# EAGLE schematic brush (EAGLE 9.5.1)
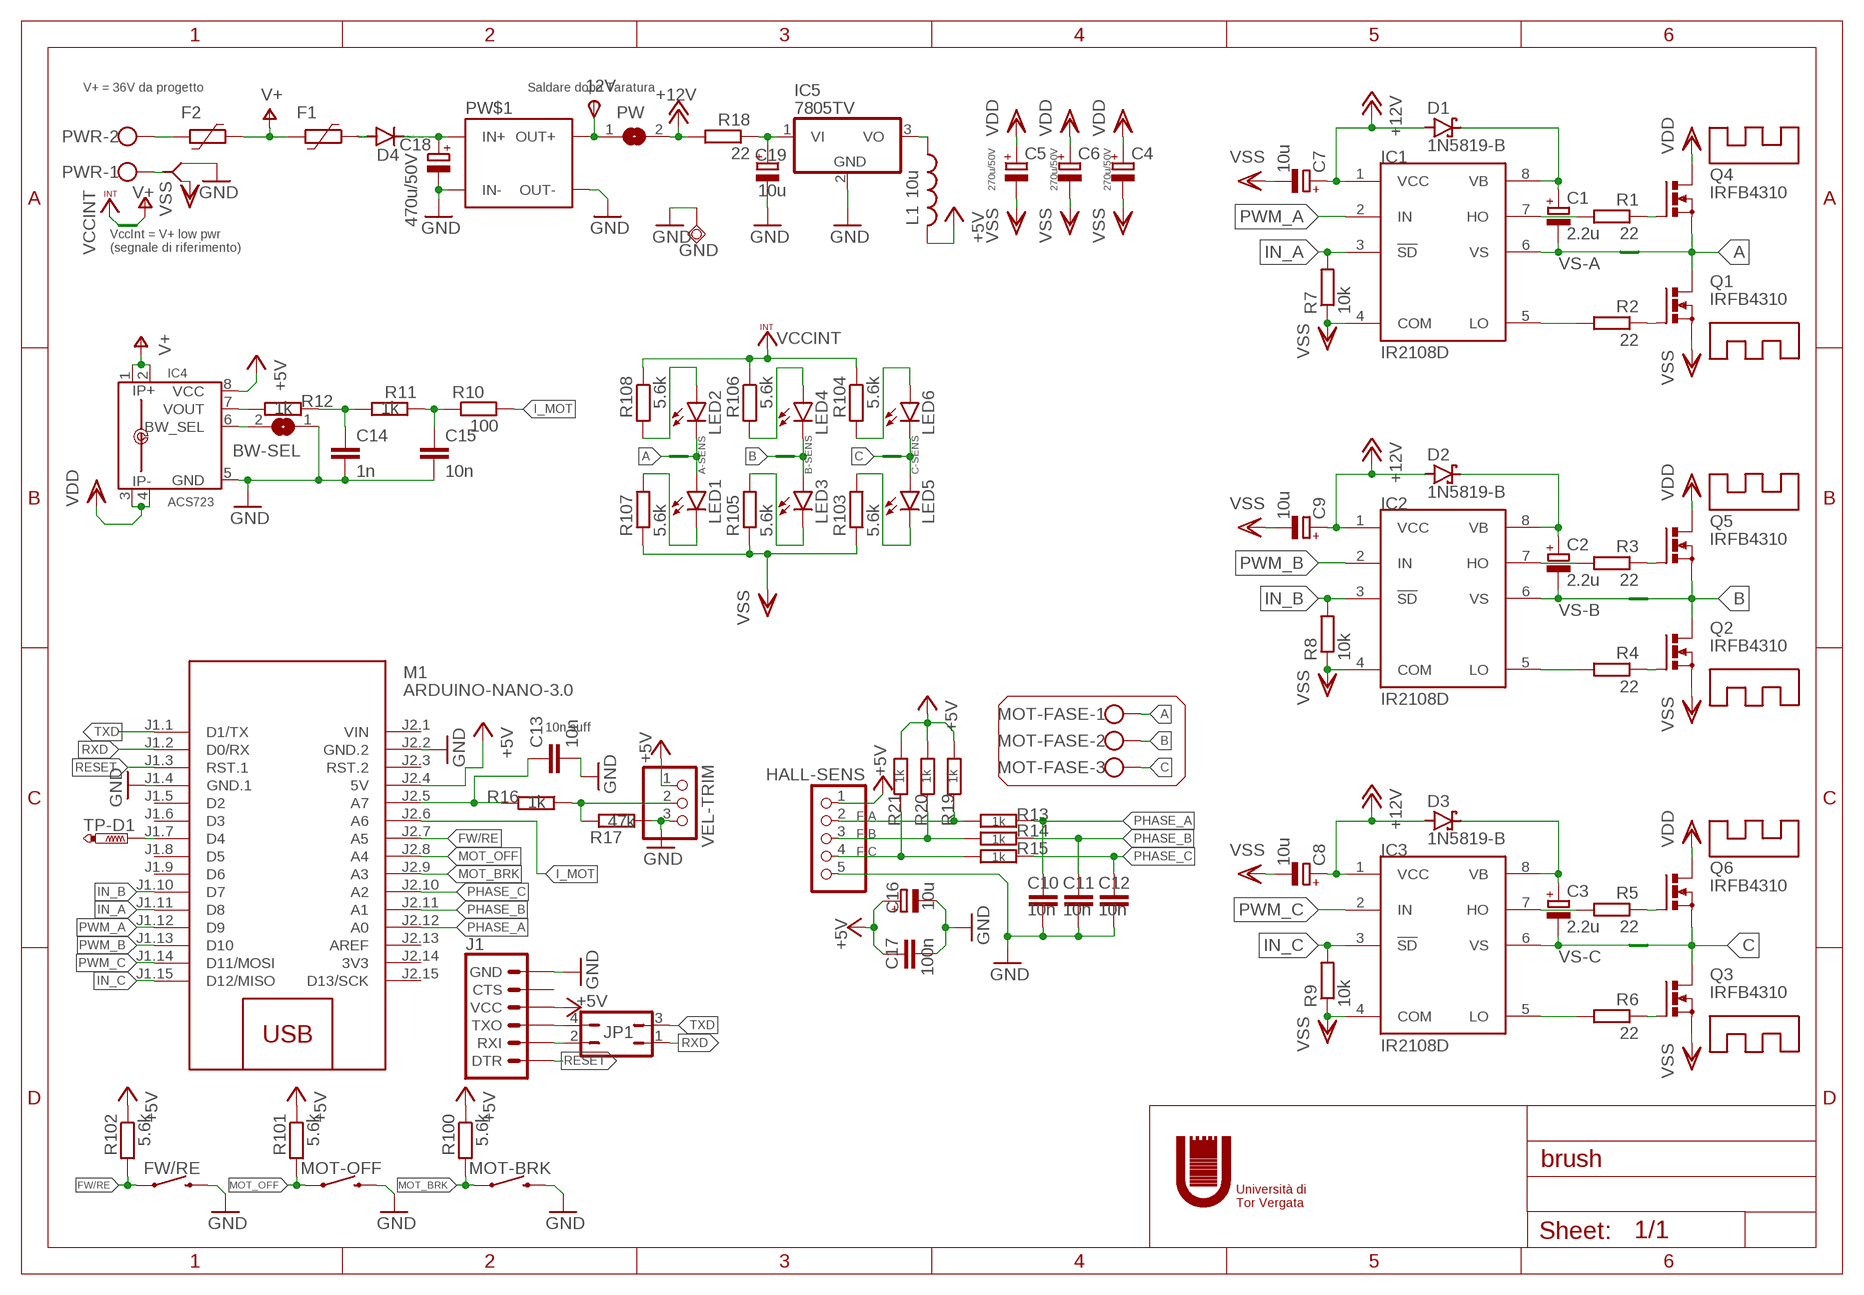
[diagram p0: schematic, sheet 1]

## Parts
12V  TPSPAD1-13  [P1-13]
BW-SEL  SJ  [SJ]
C1  2.2u  CPOL-EUE5-6  [E5-6]
C2  2.2u  CPOL-EUE5-6  [E5-6]
C3  2.2u  CPOL-EUE5-6  [E5-6]
C4  270u/50V  CPOL-EUE7.5-18  [E7,5-18]
C5  270u/50V  CPOL-EUE7.5-18  [E7,5-18]
C6  270u/50V  CPOL-EUE7.5-18  [E7,5-18]
C7  10u  CPOL-EUE5-6  [E5-6]
C8  10u  CPOL-EUE5-6  [E5-6]
C9  10u  CPOL-EUE5-6  [E5-6]
C10  10n  C-EU025-025X050  [C025-025X050]
C11  10n  C-EU025-025X050  [C025-025X050]
C12  10n  C-EU025-025X050  [C025-025X050]
C13  10n  C-EU025-025X050  [C025-025X050]
C14  1n  C-EU025-025X050  [C025-025X050]
C15  10n  C-EU025-025X050  [C025-025X050]
C16  10u  CPOL-EUE5-6  [E5-6]
C17  100n  C-EU025-025X050  [C025-025X050]
C18  470u/50V  CPOL-EUE5-13  [E5-13]
C19  10u  CPOL-EUE5-6  [E5-6]
D1  1N5819-B  [DO41-7.6]
D2  1N5819-B  [DO41-7.6]
D3  1N5819-B  [DO41-7.6]
D4  ES2D  [SMB]
F1  2410-BOX  [BELFUSE0679-3000-12]
F2  2410-BOX  [BELFUSE0679-3000-12]
FW/RE  MOMENTARY-SWITCH-SPST-PTH-6.0MM  [TACTILE_SWITCH_PTH_6.0MM]
GND  TPSQPAD1-13  [P1-13]
HALL-SENS  PINHD-1X5  [1X05]
IC1  IR2108D  [DIL08]
IC2  IR2108D  [DIL08]
IC3  IR2108D  [DIL08]
IC4  ACS723  [SOIC8]
IC5  7805TV  [TO220V]
J1  6_PIN_SERIAL_TARGETSILK  [6_PIN_SERIAL_TARGET_SIDE_W_SILK]
JP1  JP2Q  [JP2Q]
L1  10u  L-US0207/5V  [0207/5V]
LED1  LED3MM  [LED3MM]
LED2  LED3MM  [LED3MM]
LED3  LED3MM  [LED3MM]
LED4  LED3MM  [LED3MM]
LED5  LED3MM  [LED3MM]
LED6  LED3MM  [LED3MM]
M1  ARDUINO-NANO-3.0  [ARDUINO-NANO-3.0]
MOT-BRK  MOMENTARY-SWITCH-SPST-PTH-6.0MM  [TACTILE_SWITCH_PTH_6.0MM]
MOT-FASE  W237-103  [W237-103]
MOT-OFF  MOMENTARY-SWITCH-SPST-PTH-6.0MM  [TACTILE_SWITCH_PTH_6.0MM]
PW  SJ  [SJ]
PW$1  DC/DC-STEP-DOWNOLD-ALFY  [DC-DC-STEP-DOWN-LM2596-ALFY]
PWR  W237-102  [W237-102]
Q1  IRFB4310  PMOSFET_NTO220BV  [TO220BV]
Q2  IRFB4310  PMOSFET_NTO220BV  [TO220BV]
Q3  IRFB4310  PMOSFET_NTO220BV  [TO220BV]
Q4  IRFB4310  PMOSFET_NTO220BV  [TO220BV]
Q5  IRFB4310  PMOSFET_NTO220BV  [TO220BV]
Q6  IRFB4310  PMOSFET_NTO220BV  [TO220BV]
R1  22  R-EU_R1206  [R1206]
R2  22  R-EU_R1206  [R1206]
R3  22  R-EU_R1206  [R1206]
R4  22  R-EU_R1206  [R1206]
R5  22  R-EU_R1206  [R1206]
R6  22  R-EU_R1206  [R1206]
R7  10k  R-EU_R1206  [R1206]
R8  10k  R-EU_R1206  [R1206]
R9  10k  R-EU_R1206  [R1206]
R10  100  R-EU_R1206  [R1206]
R11  1k  R-EU_R1206  [R1206]
R12  1k  R-EU_R1206  [R1206]
R13  1k  R-EU_R1206  [R1206]
R14  1k  R-EU_R1206  [R1206]
R15  1k  R-EU_R1206  [R1206]
R16  1k  R-EU_R1206  [R1206]
R17  47k  R-EU_R1206  [R1206]
R18  22  R-EU_0204/7  [0204/7]
R19  1k  R-EU_R1206  [R1206]
R20  1k  R-EU_R1206  [R1206]
R21  1k  R-EU_R1206  [R1206]
R100  5.6k  R-EU_R1206  [R1206]
R101  5.6k  R-EU_R1206  [R1206]
R102  5.6k  R-EU_R1206  [R1206]
R103  5.6k  R-EU_R1206  [R1206]
R104  5.6k  R-EU_R1206  [R1206]
R105  5.6k  R-EU_R1206  [R1206]
R106  5.6k  R-EU_R1206  [R1206]
R107  5.6k  R-EU_R1206  [R1206]
R108  5.6k  R-EU_R1206  [R1206]
TP-D1  PTR1PAD1-17  [P1-17]
U$1  NET12X12  [NET-NET_12X12MIL]
U$2  NET12X12  [NET-NET_12X12MIL]
U$3  DISSTO-220  [TO-220]
U$4  DISSTO-220  [TO-220]
U$6  NET12X12  [NET-NET_12X12MIL]
U$7  DISSTO-220  [TO-220]
U$8  DISSTO-220  [TO-220]
U$9  DISSTO-220  [TO-220]
U$10  DISSTO-220  [TO-220]
U$11  NET12X12  [NET-NET_12X12MIL]
U$12  NET12X12  [NET-NET_12X12MIL]
U$13  NET12X12  [NET-NET_12X12MIL]
U$14  NET12X12  [NET-NET_12X12MIL]
U$100  3NET25X50MIL  [3NET-25X50MIL]
VEL-TRIM  PINHD-1X3  [1X03]

## Nets
+5V [PWR_logic]: C16.+ C17.1 HALL-SENS.1 IC4.8(VCC) J1.P$4(VCC) L1.2 M1.J2.4(5V) R19.2 R20.2 R21.2 R100.1 R101.1 R102.1 VEL-TRIM.1
+12V [PWR_logic]: C7.+ C8.+ C9.+ D1.A D2.A D3.A IC1.1(VCC) IC2.1(VCC) IC3.1(VCC) PW.2 R18.2
A [PWR_Mot]: MOT-FASE.1 Q1.D Q4.S U$1.N2 U$11.N2
A-SENS [AC_signal]: LED1.A LED2.K(C) U$1.N1
B [PWR_Mot]: MOT-FASE.2 Q2.D Q5.S U$2.N2 U$13.N2
B-SENS [AC_signal]: LED3.A LED4.K(C) U$2.N1
C [PWR_Mot]: MOT-FASE.3 Q3.D Q6.S U$6.N2 U$12.N2
C-SENS [AC_signal]: LED5.A LED6.K(C) U$6.N1
F-A: HALL-SENS.2 R13.2 R19.1
F-B: HALL-SENS.3 R14.2 R20.1
F-C: HALL-SENS.4 R15.2 R21.1
FW/RE: FW/RE.1 M1.J2.7(A5) R102.2
GND [PWR_logic]: BW-SEL.1 C10.2 C11.2 C12.2 C13.2 C14.2 C15.2 C16.- C17.2 C18.- C19.- FW/RE.3 GND.TP HALL-SENS.5 IC4.5(GND) IC5.2(GND) J1.P$6(GND) M1.J1.4(GND.1) M1.J2.2(GND.2) MOT-BRK.3 MOT-OFF.3 PW$1.IN- PW$1.OUT- R17.2 U$100.S2 VEL-TRIM.3
I_MOT: M1.J2.6(A6) R10.2
IN_A: IC1.3(!SD) M1.J1.11(D8) R7.2
IN_B: IC2.3(!SD) M1.J1.10(D7) R8.2
IN_C: IC3.3(!SD) M1.J1.15(D12/MISO) R9.2
MOT_BRK: M1.J2.9(A3) MOT-BRK.1 R100.2
MOT_OFF: M1.J2.8(A4) MOT-OFF.1 R101.2
N$1 [PWR_logic]: IC1.7(HO) R1.2
N$2 [PWR_logic]: IC1.5(LO) R2.2
N$3 [PWR_logic]: Q4.G R1.1
N$4 [PWR_logic]: Q1.G R2.1
N$5 [PWR_logic]: IC2.7(HO) R3.2
N$6 [PWR_logic]: Q5.G R3.1
N$7 [PWR_logic]: IC2.5(LO) R4.2
N$8 [PWR_logic]: Q2.G R4.1
N$9 [PWR_logic]: IC3.7(HO) R5.2
N$10 [PWR_logic]: Q6.G R5.1
N$11 [PWR_logic]: IC3.5(LO) R6.2
N$12 [PWR_logic]: Q3.G R6.1
N$13 [PWR_Mot]: F2.2 PWR.2
N$14 [PWR_logic]: 12V.TP(PP) PW$1.OUT+ PW.1
N$16 [PWR_Mot]: D4.A F1.1
N$18 [PWR_Mot]: PWR.1 U$100.COM
N$19 [AC_signal]: LED2.A R108.2
N$20 [AC_signal]: LED1.K(C) R107.2
N$21: C13.1 M1.J2.5(A7) R16.2
N$22 [AC_signal]: LED4.A R106.2
N$23 [AC_signal]: LED3.K(C) R105.2
N$24: M1.J1.7(D4) TP-D1.TP
N$25 [AC_signal]: LED6.A R104.2
N$26 [AC_signal]: LED5.K(C) R103.2
N$27 [PWR_Mot]: C18.+ D4.C PW$1.IN+
N$28: C15.1 R10.1 R11.1
N$29: IC4.7(VOUT) R12.2
N$30 [PWR_logic]: C19.+ IC5.1(VI) R18.1
N$31 [PWR_logic]: IC5.3(VO) L1.1
N$32: BW-SEL.2 IC4.6(BW_SEL)
N$33: R16.1 R17.1 VEL-TRIM.2
N$34: J1.P$2(TXO) JP1.4
N$35: J1.P$3(RXI) JP1.2
N$36: C14.1 R11.2 R12.1
PHASE_A: C10.1 M1.J2.12(A0) R13.1
PHASE_B: C11.1 M1.J2.11(A1) R14.1
PHASE_C: C12.1 M1.J2.10(A2) R15.1
PWM_A: IC1.2(IN) M1.J1.12(D9)
PWM_B: IC2.2(IN) M1.J1.13(D10)
PWM_C: IC3.2(IN) M1.J1.14(D11/MOSI)
RESET: J1.P$1(DTR) M1.J1.3(RST.1)
RXD: JP1.1 M1.J1.2(D0/RX)
TXD: JP1.3 M1.J1.1(D1/TX)
V+ [PWR_Mot]: F1.2 F2.1 IC4.1(IP+) IC4.2(IP+1) U$14.N2
VBA [PWR_logic]: C1.+ D1.C IC1.8(VB)
VBB [PWR_logic]: C2.+ D2.C IC2.8(VB)
VBC [PWR_logic]: C3.+ D3.C IC3.8(VB)
VCCINT [AC_signal]: R104.1 R106.1 R108.1 U$14.N1
VDD [PWR_Mot]: C4.+ C5.+ C6.+ IC4.3(IP-) IC4.4(IP-1) Q4.D Q5.D Q6.D
VS-A [AC_signal]: C1.- IC1.6(VS) U$11.N1
VS-B [AC_signal]: C2.- IC2.6(VS) U$13.N1
VS-C [AC_signal]: C3.- IC3.6(VS) U$12.N1
VSS [PWR_Mot]: C4.- C5.- C6.- C7.- C8.- C9.- IC1.4(COM) IC2.4(COM) IC3.4(COM) Q1.S Q2.S Q3.S R7.1 R8.1 R9.1 R103.1 R105.1 R107.1 U$100.S1
Unconnected: J1.P$5(CTS) M1.J1.5(D2) M1.J1.6(D3) M1.J1.8(D5) M1.J1.9(D6) M1.J2.3(RST.2) M1.J2.13(AREF) M1.J2.15(D13/SCK)

## Notes on the sheet
- V+ = 36V da progetto | Saldare dopo Taratura
- VccInt = V+ low pwr
  (segnale di riferimento)
- 10n suff

## Power pins joined to a net without a drawn wire
3V3: M1.J2.14(3V3)
VIN: M1.J2.1(VIN)

## Library data of the parts
12V = testpad:TPS: TEST PIN
BW-SEL PW = jumper:SJ: SMD solder JUMPER
C1-C9 C16 C18 C19 = rcl:CPOL-EU: POLARIZED CAPACITOR, European symbol; SPICEPREFIX: C
C10-C15 C17 = rcl:C-EU: CAPACITOR, European symbol; SPICEPREFIX: C
D1-D3 = diode:1N581*: 1.0A SCHOTTKY BARRIER RECTIFIER Source: http://www.diodes.com/datasheets/ds23001.pdf
D4 = diode:ES2D: DIODE super fast rectifier, 2 A
F1 F2 = polyfuse-smd_10:?: Polyfuse Resettable PTC Source: http://www.littelfuse.com/products/resettable-ptcs.aspx
FW/RE MOT-BRK MOT-OFF = SparkFun-Switches:MOMENTARY-SWITCH-SPST: Momentary Switch (Pushbutton) - SPST Normally-open (NO) SPST momentary switches (buttons, pushbuttons). Variants PTH-12MM - 12mm square, through-hole Momentary Pushbutton Switch - 12mm Square <https://www.sparkfun.com/products/9190> (COM-09190) PTH-6.0MM, PTH-6.0MM-KIT - 6.0mm square, through-hole Mini Pushbutton Switch <https://www.sparkfun.com/products/97> (COM-00097) KIT package intended for soldering kit's - only one side of pads' copper is exposed. PTH-RIGHT-ANGLE-KIT - Right-angle, through-hole Right Angle Tactile Button <https://www.sparkfun.com/products/10791> - Used on SparkFun BigTime Watch Kit <https://www.sparkfun.com/products/11734> SMD-12MM - 12mm square, surface-mount Tactile Button - SMD (12mm) <https://www.sparkfun.com/products/12993> (COM-12993) Used on SparkFun PicoBoard <https://www.sparkfun.com/products/11888> SMD-4.5MM - 4.5mm Square Trackball Switch Used on SparkFun Blackberry Trackballer Breakout <https://www.sparkfun.com/products/13169> SMD-4.6MMX2.8MM - 4.60mm x 2.80mm, surface mount Used on SparkFun SAMD21 Mini Breakout <https://www.sparkfun.com/products/13664> SMD-5.2MM, SMD-5.2-REDUNDANT - 5.2mm square, surface-mount Mini Pushbutton Switch - SMD <https://www.sparkfun.com/products/8720> (COM-08720) Used on Arduino Pro Mini <https://www.sparkfun.com/products/11114> REDUNDANT package connects both switch circuits together SMD-6.0X3.5MM - 6.0 x 3.5mm, surface mount Momentary Reset Switch SMD <https://www.sparkfun.com/products/8229> (COM-08229) SMD-6.2MM-TALL - 6.2mm square, surface mount Tactile Button - SMD (6mm) <https://www.sparkfun.com/products/12992> Used on SparkFun Digital Sandbox <https://www.sparkfun.com/products/12651> SMD-RIGHT-ANGLE - Right-angle, surface mount Used on SparkFun Block for Intel® Edison - Arduino <https://www.sparkfun.com/products/13036>; PROD_ID: SWCH-08441; SF_SKU: COM-00097
GND = testpad:TPSQ: Test pad
HALL-SENS = pinhead:PINHD-1X5: PIN HEADER
IC1-IC3 = irs:IR2108
IC4 = allegro-2:ACS723
IC5 = linear:78*: Positive VOLTAGE REGULATOR Source: http://cache.national.com/ds/LM/LM78L05.pdf http://www.fairchildsemi.com/ds/LM/LM7805.pdf
J1 = SparkFun-Connectors:6_PIN_SERIAL_TARGET: 6-pin header connection for use with the "FTDI BASIC" pinout - TARGET SIDE. Also known as "Arduino Serial Program Header". It is used to mate with our FTDI Basic serial programmers using the Arduino IDE. Note, this device has "TARGET" in the name. It is intended to be used on a design that contains a target micro-controller that you wish to program. The "sister" device, named "CABLE" is inteneded to be used on a design that usually lives on the end of your USB cable and prvides the converter chip (FTDI232 or FTDI231x) to commnicate serial RX/TX. You can populate with some of these: Break Away Headers - Straight <https://www.sparkfun.com/products/116> (PRT-00116) For reference (or to suit your programming needs) check out these designs: SparkFun FTDI Basic Breakout - 5V <https://www.sparkfun.com/products/9716> (DEV-09716) SparkFun FTDI Basic Breakout - 3.3V <https://www.sparkfun.com/products/9873> (DEV-09873) SparkFun FTDI SmartBasic <https://www.sparkfun.com/products/12935> (DEV-12935) SparkFun Beefy 3 - FTDI Basic Breakout <https://www.sparkfun.com/products/13746> (DEV-13746)
JP1 = jumper:JP2Q: JUMPER
L1 = rcl:L-US: INDUCTOR, American symbol; SPICEPREFIX: L
LED1-LED6 = led:LED: LED OSRAM: - CHIPLED LG R971, LG N971, LY N971, LG Q971, LY Q971, LO R971, LY R971 LH N974, LH R974 LS Q976, LO Q976, LY Q976 LO Q996 - Hyper CHIPLED LW Q18S LB Q993, LB Q99A, LB R99A - SideLED LS A670, LO A670, LY A670, LG A670, LP A670 LB A673, LV A673, LT A673, LW A673 LH A674 LY A675 LS A676, LA A676, LO A676, LY A676, LW A676 LS A679, LY A679, LG A679 - Hyper Micro SIDELED® LS Y876, LA Y876, LO Y876, LY Y876 LT Y87S - SmartLED LW L88C, LW L88S LB L89C, LB L89S, LG L890 LS L89K, LO L89K, LY L89K LS L896, LA L896, LO L896, LY L896 - TOPLED LS T670, LO T670, LY T670, LG T670, LP T670 LSG T670, LSP T670, LSY T670, LOP T670, LYG T670 LG T671, LOG T671, LSG T671 LB T673, LV T673, LT T673, LW T673 LH T674 LS T676, LA T676, LO T676, LY T676, LB T676, LH T676, LSB T676, LW T676 LB T67C, LV T67C, LT T67C, LS T67K, LO T67K, LY T67K, LW E67C LS E67B, LA E67B, LO E67B, LY E67B, LB E67C, LV E67C, LT E67C LW T67C LS T679, LY T679, LG T679 LS T770, LO T770, LY T770, LG T770, LP T770 LB T773, LV T773, LT T773, LW T773 LH T774 LS E675, LA E675, LY E675, LS T675 LS T776, LA T776, LO T776, LY T776, LB T776 LHGB T686 LT T68C, LB T68C - Hyper Mini TOPLED® LB M676 - Mini TOPLED Santana® LG M470 LS M47K, LO M47K, LY M47K Source: http://www.osram.convergy.de LUXEON: - LUMILED® LXK2-PW12-R00, LXK2-PW12-S00, LXK2-PW14-U00, LXK2-PW14-V00 LXK2-PM12-R00, LXK2-PM12-S00, LXK2-PM14-U00 LXK2-PE12-Q00, LXK2-PE12-R00, LXK2-PE12-S00, LXK2-PE14-T00, LXK2-PE14-U00 LXK2-PB12-K00, LXK2-PB12-L00, LXK2-PB12-M00, LXK2-PB14-N00, LXK2-PB14-P00, LXK2-PB14-Q00 LXK2-PR12-L00, LXK2-PR12-M00, LXK2-PR14-Q00, LXK2-PR14-R00 LXK2-PD12-Q00, LXK2-PD12-R00, LXK2-PD12-S00 LXK2-PH12-R00, LXK2-PH12-S00 LXK2-PL12-P00, LXK2-PL12-Q00, LXK2-PL12-R00 Source: www.luxeon.com KINGBRIGHT: KA-3528ASYC Source: www.kingbright.com
M1 = diy-modules:ARDUINO-NANO-3.0: Arduino Nano 3.0
MOT-FASE = con-wago-500:W237-103: WAGO SCREW CLAMP; MPN: 237-103; OC_FARNELL: unknown; OC_NEWARK: 18M7116
PW$1 = diy-modules:DC/DC-STEP-DOWN: Step-down DC/DC basato su mp1584
PWR = con-wago-500:W237-102: WAGO SCREW CLAMP; MPN: 237-102; OC_FARNELL: unknown; OC_NEWARK: 70K9898
Q1-Q6 = transistor-power:PMOSFET_N: Power MOSFET N-Channel
R1-R21 R100-R108 = rcl:R-EU_: RESISTOR, European symbol; SPICEPREFIX: R
TP-D1 = testpad:PTR1: TEST PIN
U$1 U$2 U$6 U$11-U$14 = junctions_net:NET
U$3 U$4 U$7-U$10 = diss:DISS
U$100 = junctions_net:3NET
VEL-TRIM = pinhead:PINHD-1X3: PIN HEADER

## Net classes
0 default: width 0.152 mm, clearance 0.152 mm
1 PWR_Mot: width 1.524 mm, drill 1.016 mm, clearance 0.305 mm
2 PWR_logic: width 0.254 mm, drill 0.152 mm, clearance 0.203 mm
3 AC_signal: width 0.152 mm, clearance 0.152 mm